# Altium schematic sheet MCU_Clock_Led.SchDoc
size A4; SheetNumber: 1; SheetTotal: 8
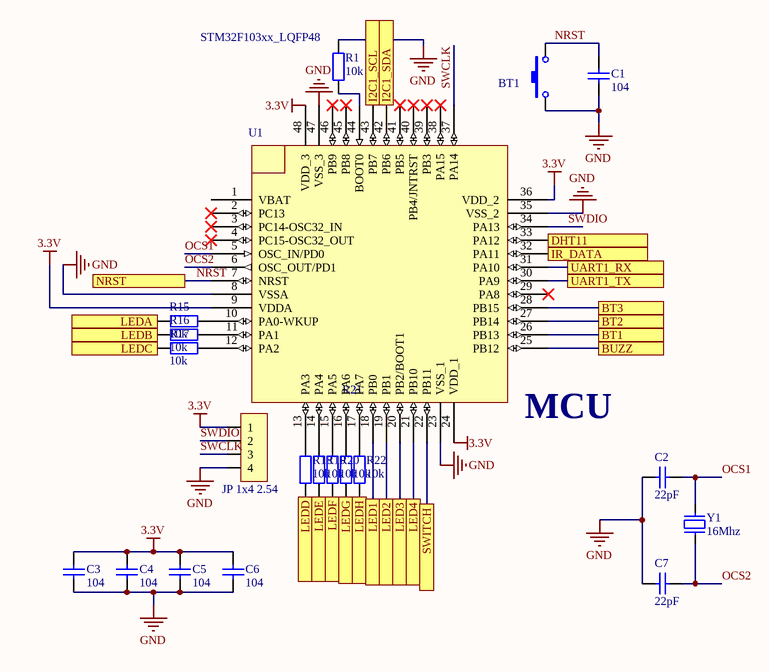
[diagram p0: MCU_Clock_Led.SchDoc]

## Parts
BT1  Nut Nhan 2 Chan SMD 3x6x2.5  [Nut Nhan 2 Chan SMD 3x6x2.5]  (value not drawn)
C1  104  [tu 0805]
C2  22pF  [tu 0805]
C3  104  [tu 0805]
C4  104  [tu 0805]
C5  104  [tu 0805]
C6  104  [tu 0805]
C7  22pF  [tu 0805]
JP2  JP 1x4 2.54  [JP 1x4 DT]
R1  10k  [tro smd 0805]
R15  10k  [tro smd 0805]
R16  10k  [tro smd 0805]
R17  10k  [tro smd 0805]
R18  10k  [tro smd 0805]
R19  10k  [tro smd 0805]
R20  10k  [tro smd 0805]
R21  10k  [tro smd 0805]
R22  10k  [tro smd 0805]
U1  STM32F103xx_LQFP48  [STM32_LQPF48]
Y1  16Mhz  [Thach Anh 2 chan SMD]

## Ports
BT1, BT2, BT3, BUZZ, DHT11, I2C1_SCL, I2C1_SDA, IR_DATA, LED1, LED2, LED3, LED4, LEDA, LEDB, LEDC, LEDD, LEDE, LEDF, LEDG, LEDH, NRST, SWITCH, UART1_RX, UART1_TX

## Nets
3.3V: C3.1 C4.1 C5.1 C6.1 JP2.1 U1.9(VDDA) U1.24(VDD_1) U1.36(VDD_2) U1.48(VDD_3)
GND: BT1.1 C1.2 C2.1 C3.2 C4.2 C5.2 C6.2 C7.1 JP2.4 R1.2 U1.8(VSSA) U1.23(VSS_1) U1.35(VSS_2) U1.47(VSS_3)
BT1: U1.26(PB13) ; port BT1
BT2: U1.27(PB14) ; port BT2
BT3: U1.28(PB15) ; port BT3
BUZZ: U1.25(PB12) ; port BUZZ
DHT11: U1.33(PA12) ; port DHT11
I2C1_SCL: U1.43(PB7) ; port I2C1_SCL
I2C1_SDA: U1.42(PB6) ; port I2C1_SDA
IR_DATA: U1.32(PA11) ; port IR_DATA
LED1: U1.18(PB0) ; port LED1
LED2: U1.19(PB1) ; port LED2
LED3: U1.20(PB2/BOOT1) ; port LED3
LED4: U1.21(PB10) ; port LED4
LEDA: R15.1 ; port LEDA
LEDB: R16.1 ; port LEDB
LEDC: R17.1 ; port LEDC
LEDD: R18.1 ; port LEDD
LEDE: R19.1 ; port LEDE
LEDF: R20.1 ; port LEDF
LEDG: R21.1 ; port LEDG
LEDH: R22.1 ; port LEDH
NRST: BT1.2 C1.1 U1.7(NRST) ; port NRST
OCS1: C2.2 U1.5(OSC_IN/PD0) Y1.2
OCS2: C7.2 U1.6(OSC_OUT/PD1) Y1.1
SWCLK: JP2.3 U1.37(PA14)
SWDIO: JP2.2 U1.34(PA13)
SWITCH: U1.22(PB11) ; port SWITCH
UART1_RX: U1.31(PA10) ; port UART1_RX
UART1_TX: U1.30(PA9) ; port UART1_TX
NetR1_1: R1.1 U1.44(BOOT0)
NetR15_2: R15.2 U1.10(PA0-WKUP)
NetR16_2: R16.2 U1.11(PA1)
NetR17_2: R17.2 U1.12(PA2)
NetR18_2: R18.2 U1.13(PA3)
NetR19_2: R19.2 U1.14(PA4)
NetR20_2: R20.2 U1.15(PA5)
NetR21_2: R21.2 U1.16(PA6)
NetR22_2: R22.2 U1.17(PA7)

Not connected (* = marked no-connect by the designer): U1 1(VBAT) 2(PC13)* 3(PC14-OSC32_IN)* 4(PC15-OSC32_OUT)* 29(PA8)* 38(PA15)* 39(PB3)* 40(PB4/JNTRST)* 41(PB5)* 45(PB8)* 46(PB9)*

## Notes on the sheet
- (near U1) MCU

## Library data of the parts
BT1 = Nut Nhan 2 Chan SMD 3x6x2.5: Ma_Hang: MH001036; Ten: Nút Nhấn 2 Chân 3x6x2.5MM SMD
C1 C3-C6 = Tu 0805 104 50V 10%: Dán; Don_Vi: Con; So_Chan: 2; Ten_Linh_Kien: Tụ 0805 104-100nF 10% 50V; Ma_Hang: MH004551; Chung_Loai: Dán; Kieu_Chan: *
C2 C7 = Tu 0805 22pF 50V 10%: Dán; Don_Vi: Con; So_Chan: 2; Ten_Linh_Kien: Tụ 0805 22P 10% 50V; Ma_Hang: MH004560; Chung_Loai: Dán; Kieu_Chan: *
JP2 = JP 1x4 2.54 Duc Thang: Cắm; Ten_Linh_Kien: Jump Đơn Đực 2.54MM 1x40P Thẳng 11MM; Don_Vi: Con; Ma_Hang: MH000903; Ghi_Chu: *; Kieu_Chan: *; Chung_Loai: Cắm
R1 R15-R22 = Tro 0805 5% 10k: Dán; Don_Vi: Con; So_Chan: 2; Ten_Linh_Kien: Trở 0805 5% 10k; Ma_Hang: MH005239; Chung_Loai: Dán; Kieu_Chan: *
Y1 = Thach Anh 2 chan SMD: Crystal For all Crystal 2pin.; Value: 4Mhz
U1 = STM32F103xx_LQFP48: Published: 30-May-2008; DatasheetVersion: rev6, Mar-2008; PackageVersion: Mar-2008; PackageReference: LQFP48; Publisher: Altium Limited; PackageDescription: 48-Pin Low-Profile Quad Flat Pack, 7 x 7 mm Body, 0.5 mm Pitch (LQFP48); ComponentLink1Description: Manufacturer Link; ComponentLink1URL: www.st.com/stm32; ComponentLink2Description: Datasheet; ComponentLink2URL: http://www.st.com/stonline/products/literature/ds/13587.pdf